# Altium schematic sheet System Wake Interupt Logic.SchDoc: System Wake up Resources Logic Gates
size A3; SheetNumber: 8; SheetTotal: 37
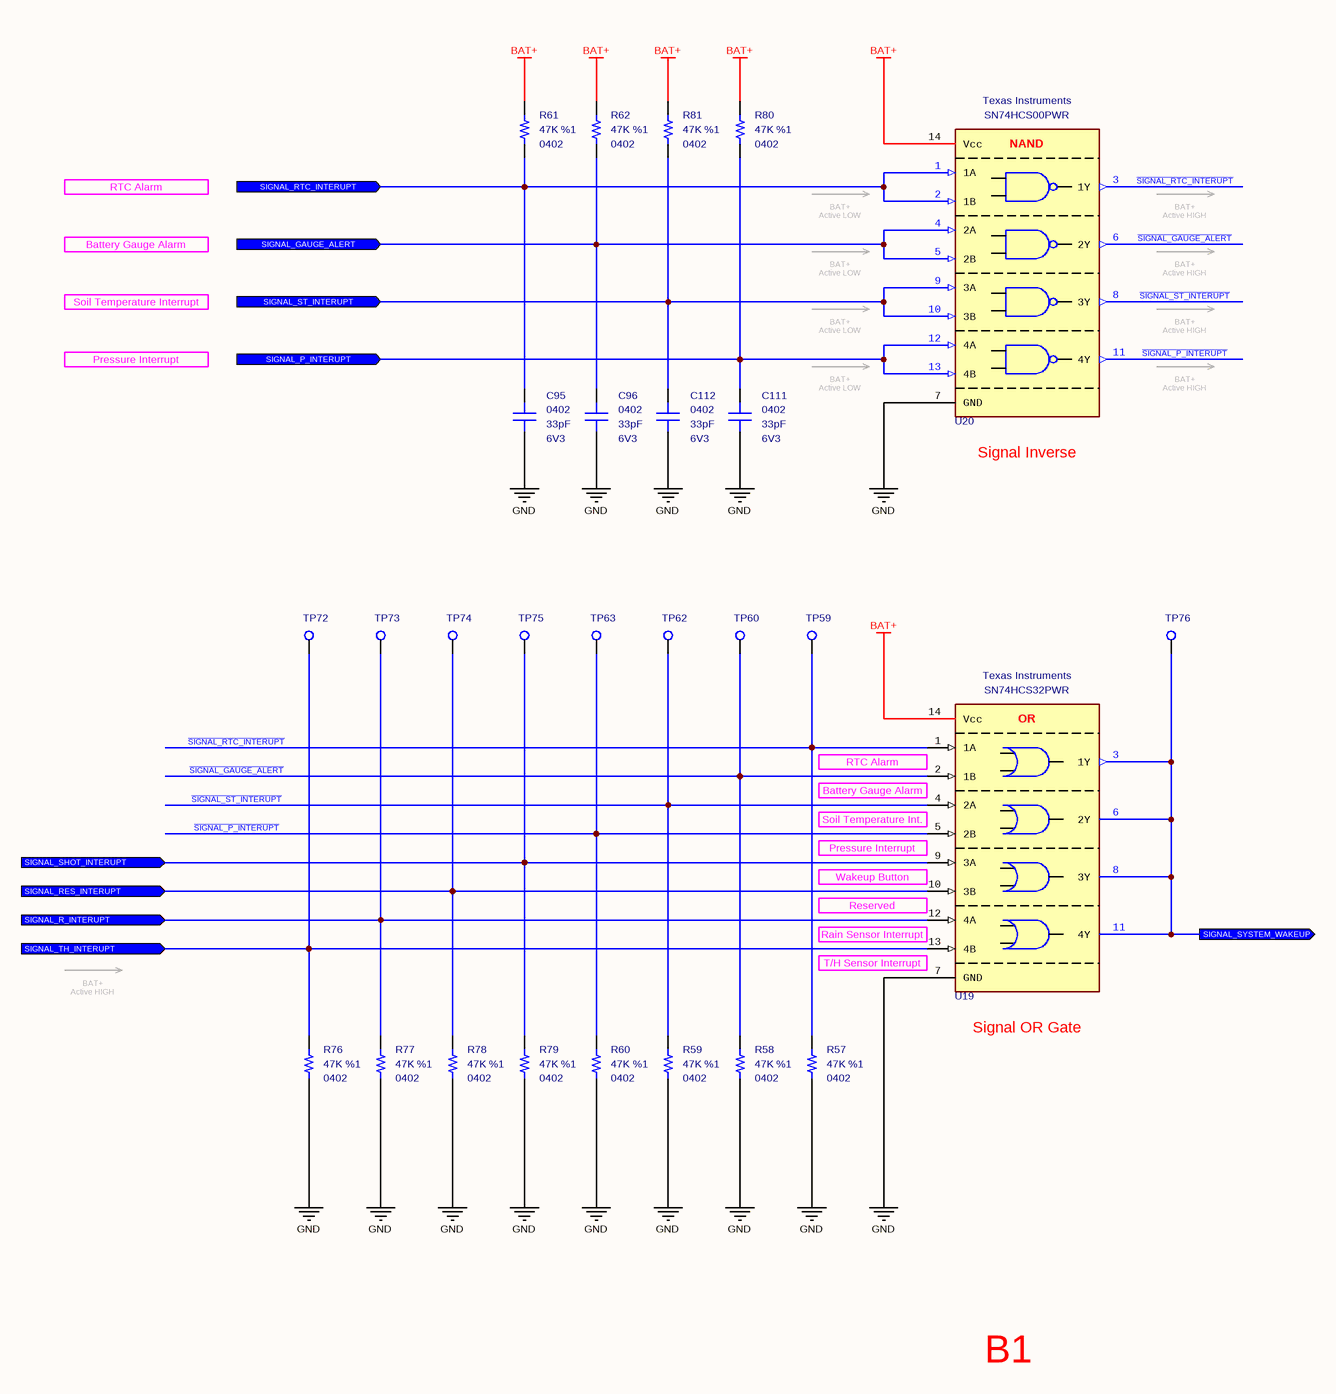
[diagram p0: System Wake Interupt Logic.SchDoc]

## Parts
C95  value 33pF  Case: 0402  Voltage: 6V3  [CAPACITOR_0402]  (hidden comment: Multilayer Ceramic Capacitor)
C96  value 33pF  Case: 0402  Voltage: 6V3  [CAPACITOR_0402]  (hidden comment: Multilayer Ceramic Capacitor)
C111  value 33pF  Case: 0402  Voltage: 6V3  [CAPACITOR_0402]  (hidden comment: Multilayer Ceramic Capacitor)
C112  value 33pF  Case: 0402  Voltage: 6V3  [CAPACITOR_0402]  (hidden comment: Multilayer Ceramic Capacitor)
R57  value 47K  Tolerance: %1  Case: 0402  [RESISTOR_0402]  (hidden comment: Thick Film Resistor)
R58  value 47K  Tolerance: %1  Case: 0402  [RESISTOR_0402]  (hidden comment: Thick Film Resistor)
R59  value 47K  Tolerance: %1  Case: 0402  [RESISTOR_0402]  (hidden comment: Thick Film Resistor)
R60  value 47K  Tolerance: %1  Case: 0402  [RESISTOR_0402]  (hidden comment: Thick Film Resistor)
R61  value 47K  Tolerance: %1  Case: 0402  [RESISTOR_0402]  (hidden comment: Thick Film Resistor)
R62  value 47K  Tolerance: %1  Case: 0402  [RESISTOR_0402]  (hidden comment: Thick Film Resistor)
R76  value 47K  Tolerance: %1  Case: 0402  [RESISTOR_0402]  (hidden comment: Thick Film Resistor)
R77  value 47K  Tolerance: %1  Case: 0402  [RESISTOR_0402]  (hidden comment: Thick Film Resistor)
R78  value 47K  Tolerance: %1  Case: 0402  [RESISTOR_0402]  (hidden comment: Thick Film Resistor)
R79  value 47K  Tolerance: %1  Case: 0402  [RESISTOR_0402]  (hidden comment: Thick Film Resistor)
R80  value 47K  Tolerance: %1  Case: 0402  [RESISTOR_0402]  (hidden comment: Thick Film Resistor)
R81  value 47K  Tolerance: %1  Case: 0402  [RESISTOR_0402]  (hidden comment: Thick Film Resistor)
TP59  PCB - Test Point  [Test_Pad - Hole]  (value not drawn)  (no BOM)
TP60  PCB - Test Point  [Test_Pad - Hole]  (value not drawn)  (no BOM)
TP62  PCB - Test Point  [Test_Pad - Hole]  (value not drawn)  (no BOM)
TP63  PCB - Test Point  [Test_Pad - Hole]  (value not drawn)  (no BOM)
TP72  PCB - Test Point  [Test_Pad - Hole]  (value not drawn)  (no BOM)
TP73  PCB - Test Point  [Test_Pad - Hole]  (value not drawn)  (no BOM)
TP74  PCB - Test Point  [Test_Pad - Hole]  (value not drawn)  (no BOM)
TP75  PCB - Test Point  [Test_Pad - Hole]  (value not drawn)  (no BOM)
TP76  PCB - Test Point  [Test_Pad - Hole]  (value not drawn)  (no BOM)
U19  Manufacturer_Part_Number: SN74HCS32PWR  Manufacturer_Name: Texas Instruments  [TSSOP-14]  (hidden comment: Logic Gate (OR))
U20  Manufacturer_Part_Number: SN74HCS00PWR  Manufacturer_Name: Texas Instruments  [TSSOP-14]  (hidden comment: Logic Gate (NAND))

## Ports
SIGNAL_GAUGE_ALERT (in), SIGNAL_P_INTERUPT (in), SIGNAL_R_INTERUPT (in), SIGNAL_RES_INTERUPT (in), SIGNAL_RTC_INTERUPT (in), SIGNAL_SHOT_INTERUPT (in), SIGNAL_ST_INTERUPT (in), SIGNAL_SYSTEM_WAKEUP (out), SIGNAL_TH_INTERUPT (in)

## Nets
BAT+: R61.2 R62.2 R80.2 R81.2 U19.14(Vcc) U20.14(Vcc)
GND: C95.1 C96.1 C111.1 C112.1 R57.1 R58.1 R59.1 R60.1 R76.1 R77.1 R78.1 R79.1 U19.7(GND) U20.7(GND)
~{SIGNAL_GAUGE_ALERT}: R58.2 TP60.1 U19.2(1B) U20.6(2Y)
~{SIGNAL_P_INTERUPT}: R60.2 TP63.1 U19.5(2B) U20.11(4Y)
~{SIGNAL_RTC_INTERUPT}: R57.2 TP59.1 U19.1(1A) U20.3(1Y)
~{SIGNAL_ST_INTERUPT}: R59.2 TP62.1 U19.4(2A) U20.8(3Y)
SIGNAL_GAUGE_ALERT: C96.2 R62.1 U20.4(2A) U20.5(2B) ; port SIGNAL_GAUGE_ALERT
SIGNAL_P_INTERUPT: C111.2 R80.1 U20.12(4A) U20.13(4B) ; port SIGNAL_P_INTERUPT
SIGNAL_R_INTERUPT: R77.2 TP73.1 U19.12(4A) ; port SIGNAL_R_INTERUPT
SIGNAL_RES_INTERUPT: R78.2 TP74.1 U19.10(3B) ; port SIGNAL_RES_INTERUPT
SIGNAL_RTC_INTERUPT: C95.2 R61.1 U20.1(1A) U20.2(1B) ; port SIGNAL_RTC_INTERUPT
SIGNAL_SHOT_INTERUPT: R79.2 TP75.1 U19.9(3A) ; port SIGNAL_SHOT_INTERUPT
SIGNAL_ST_INTERUPT: C112.2 R81.1 U20.9(3A) U20.10(3B) ; port SIGNAL_ST_INTERUPT
SIGNAL_SYSTEM_WAKEUP: TP76.1 U19.3(1Y) U19.6(2Y) U19.8(3Y) U19.11(4Y) ; port SIGNAL_SYSTEM_WAKEUP
SIGNAL_TH_INTERUPT: R76.2 TP72.1 U19.13(4B) ; port SIGNAL_TH_INTERUPT

## Notes on the sheet
- RTC Alarm
- BAT+
  Active LOW
- BAT+
  Active HIGH
- Battery Gauge Alarm
- Soil Temperature Interrupt
- Pressure Interrupt
- (near U20) Signal Inverse
- (near U19) RTC Alarm
- (near U19) Battery Gauge Alarm
- (near U19) Wakeup Button
- (near U19) Pressure Interrupt
- (near U19) Soil Temperature Int.
- (near U19) Rain Sensor Interrupt
- (near U19) Reserved
- (near U19) T/H Sensor Interrupt
- (near U19) Signal OR Gate
- B1
- Title
- Size:
- Date:
- A3
- Number:
- Time:
- Revision:
- Sheet
- of
- File:
- (in symbol IC - SN74HCS00) NAND
- (in symbol IC - SN74HCS32) OR

## Library data of the parts
C95 C96 C111 C112 = Capacitor - 33pF [0402-6V3]: Capacitor - 33pF [0402] (Ceramic); Manufacturer_Name: Kemet; Manufacturer_Part_Number: C0402C330J9RACAUTO; Dielectric: X7R; Tolerance: 10%; Height: 0.5mm; Mouser_Part_Number: 80-C0402C330J9RAUTO; Maximum Operating Temperature: +125; Minimum Operating Temperature: -55; ROHS: Yes; ComponentLink1Description: DataSheet; ComponentLink1URL: https://api.kemet.com/component-edge/download/datasheet/C0402C330J9RACAUTO.pdf; ComponentLink2Description: Mouser; ComponentLink2URL: https://www.mouser.com/Search/Refine.aspx?Keyword=80-C0402C330J9RAUTO; Supplier 1: Mouser; Supplier Part Number 1: 80-C0402C330J9RAUTO
R57-R62 R76-R81 = Resistor - 47K: Thick Film Resistors - SMD 1/16 W 47 Kohms 1%; Manufacturer_Name: Vishay; Manufacturer_Part_Number: CRCW040247K0FKED; Height: 0.4mm; Mouser_Part_Number: 71-CRCW0402-47K-E3; ComponentLink1Description: DataSheet; ComponentLink1URL: https://www.mouser.com.tr/datasheet/2/427/dcrcwe3-1762152.pdf; ComponentLink2Description: Mouser; ComponentLink2URL: https://www.mouser.com.tr/ProductDetail/Vishay-Dale/CRCW040247K0FKED?qs=sGAEpiMZZMu61qfTUdNhG2DpbjADlD3GL%252B3h1elTxqU%3D; Supplier 1: Mouser; Supplier 2: Digi-Key; Supplier Part Number 1: 71-CRCW040247K0FKEDH; Supplier Part Number 2: 541-47.0KYCT-ND
TP59 TP60 TP62 TP63 TP72-TP76 = PCB - Test Point: Test Point
U19 = IC - SN74HCS32: Logic Gates Quadruple 2-input OR gates with Schmitt-trigger inputs 14-TSSOP -40 to 125; Mouser_Part_Number: 595-SN74HCS32PWR; ComponentLink1Description: DataSheet; ComponentLink1URL: http://www.ti.com/lit/ds/symlink/sn74hcs32-q1.pdf; ComponentLink2Description: Mouser; ComponentLink2URL: https://eu.mouser.com/ProductDetail/Texas-Instruments/SN74HCS32PWR?qs=vHuUswq2%252BswZ59iFDX%252BOFA%3D%3D; Minimum Operating Temperature: -40; Maximum Operating Temperature: +125; Case: TSSOP-14; Supplier 1: Mouser; Supplier 2: Digi-Key; Supplier Part Number 1: 595-SN74HCS32PWR; Supplier Part Number 2: 296-SN74HCS32PWRCT-ND
U20 = IC - SN74HCS00: Logic Gates Quadruple 2-input NAND gates with Schmitt-trigger inputs 14-TSSOP -40 to 125; Mouser_Part_Number: 595-SN74HCS00PWR; ComponentLink1Description: DataSheet; ComponentLink1URL: http://www.ti.com/lit/ds/symlink/sn74hcs00.pdf; ComponentLink2Description: Mouser; ComponentLink2URL: https://eu.mouser.com/ProductDetail/Texas-Instruments/SN74HCS00PWR?qs=xZ%2FP%252Ba9zWqbLfT34gQ2%2FMQ%3D%3D; Minimum Operating Temperature: -40; Maximum Operating Temperature: +125; Case: TSSOP-14; Supplier 1: Mouser; Supplier 2: Digi-Key; Supplier Part Number 1: 595-SN74HCS00PWR; Supplier Part Number 2: 296-SN74HCS00PWRCT-ND